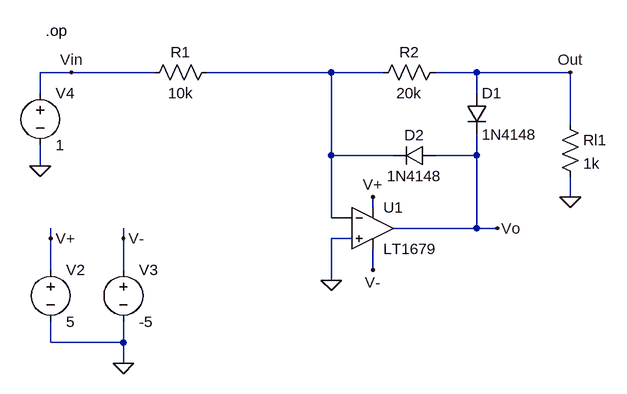
[diagram p0: schematic Etaj_4_monoalternanta_op.asc]
Etaj_4_monoalternanta_op.asc, the LTspice schematic file:
Version 4.1
SHEET 1 880 680
WIRE -112 -64 -160 -64
WIRE 16 -64 -112 -64
WIRE 288 -64 96 -64
WIRE 368 -64 288 -64
WIRE 512 -64 448 -64
WIRE 656 -64 512 -64
WIRE -160 -32 -160 -64
WIRE 512 -32 512 -64
WIRE 656 16 656 -64
WIRE 288 64 288 -64
WIRE 384 64 288 64
WIRE 512 64 512 32
WIRE 512 64 448 64
WIRE -160 80 -160 48
WIRE 656 128 656 96
WIRE 352 144 352 128
WIRE 288 160 288 64
WIRE 320 160 288 160
WIRE 512 176 512 64
WIRE 512 176 384 176
WIRE 544 176 512 176
WIRE -144 192 -144 176
WIRE -32 192 -32 176
WIRE 320 192 288 192
WIRE -144 240 -144 192
WIRE -32 240 -32 192
WIRE 352 240 352 208
WIRE 288 256 288 192
WIRE -144 352 -144 320
WIRE -32 352 -32 320
WIRE -32 352 -144 352
WIRE -32 384 -32 352
FLAG -160 80 0
FLAG 656 -64 Out
FLAG 288 256 0
FLAG 544 176 Vo
FLAG -32 384 0
FLAG -144 192 V+
FLAG -32 192 V-
FLAG 352 128 V+
FLAG 352 240 V-
FLAG -112 -64 Vin
FLAG 656 128 0
DATAFLAG 160 -64 ""
DATAFLAG 528 -64 ""
DATAFLAG 288 64 ""
DATAFLAG 512 176 ""
SYMBOL res 112 -80 R90
WINDOW 0 0 56 VBottom 2
WINDOW 3 32 56 VTop 2
SYMATTR InstName R1
SYMATTR Value 10k
SYMBOL voltage -144 224 R0
WINDOW 123 0 0 Left 2
WINDOW 39 0 0 Left 2
SYMATTR InstName V2
SYMATTR Value 5
SYMBOL voltage -32 224 R0
WINDOW 123 0 0 Left 2
WINDOW 39 0 0 Left 2
SYMATTR InstName V3
SYMATTR Value -5
SYMBOL res 464 -80 R90
WINDOW 0 0 56 VBottom 2
WINDOW 3 32 56 VTop 2
SYMATTR InstName R2
SYMATTR Value 20k
SYMBOL diode 496 -32 R0
SYMATTR InstName D1
SYMATTR Value 1N4148
SYMBOL diode 448 48 R90
WINDOW 0 0 32 VBottom 2
WINDOW 3 32 32 VTop 2
SYMATTR InstName D2
SYMATTR Value 1N4148
SYMBOL res 640 0 R0
SYMATTR InstName Rl1
SYMATTR Value 1k
SYMBOL OpAmps\\LT1679 352 176 R0
SYMATTR InstName U1
SYMBOL voltage -160 -48 R0
WINDOW 123 0 0 Left 0
WINDOW 39 0 0 Left 0
SYMATTR InstName V4
SYMATTR Value 1
TEXT -152 -128 Left 2 !.op

The netlist it stands for:
* Etaj_4_monoalternanta_op.asc
R1 N001 Vin 10k
V2 V+ 0 5
V3 V- 0 -5
R2 Out N001 20k
D1 Out Vo 1N4148
D2 Vo N001 1N4148
Rl1 Out 0 1k
* U1: LT1679 (symbol OpAmps\LT1679 not available, pins judged from their places): In+=0 In-=N001 V+=V+ V-=V- OUT=Vo
V4 Vin 0 1
.model D D
.lib standard.dio
.op
.backanno
.end